# EAGLE schematic FotoMindARShield (EAGLE 7.1.0)
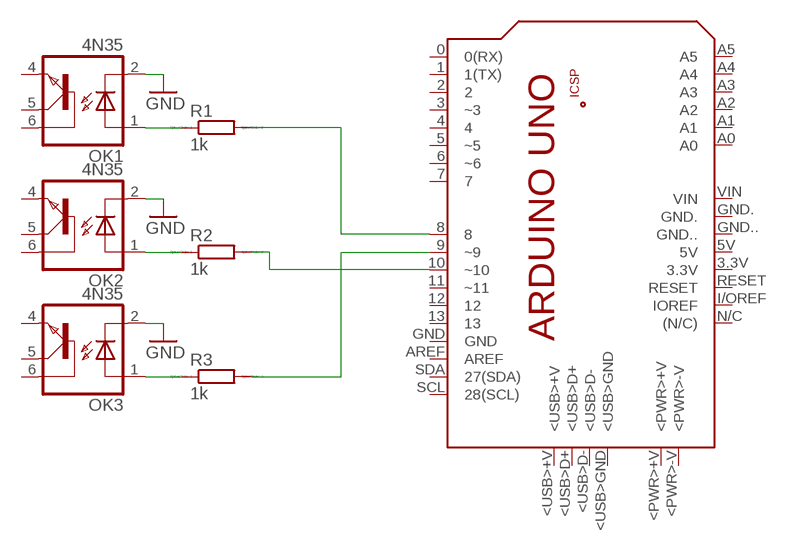
[diagram p0: schematic, sheet 1]

## Parts
OK1  4N35  [DIL06]
OK2  4N35  [DIL06]
OK3  4N35  [DIL06]
PCB1  ARDUINO_UNO  [ARDUINO_UNO]
R1  1k  R0204/7  [0204/7]
R2  1k  R0204/7  [0204/7]
R3  1k  R0204/7  [0204/7]

## Nets
GND: OK1.2(C) OK2.2(C) OK3.2(C)
N$1: OK1.1(A) R1.1
N$2: OK2.1(A) R2.1
N$3: OK3.1(A) R3.1
N$4: PCB1.8 R1.2
N$5: PCB1.10(~10) R2.2
N$6: PCB1.9(~9) R3.2
Unconnected: OK1.4(EMI) OK1.5(COL) OK1.6(BAS) OK2.4(EMI) OK2.5(COL) OK2.6(BAS) OK3.4(EMI) OK3.5(COL) OK3.6(BAS) PCB1.0(0(RX)) PCB1.1(1(TX)) PCB1.2 PCB1.3(~3) PCB1.3.3V PCB1.4 PCB1.5(~5) PCB1.5V PCB1.6(~6) PCB1.7 PCB1.11(~11) PCB1.12 PCB1.13 PCB1.+5V PCB1.<PWR>+V PCB1.<PWR>-V PCB1.<USB>+V PCB1.<USB>D+ PCB1.<USB>D- PCB1.<USB>GND PCB1.A0 PCB1.A1 PCB1.A2 PCB1.A3 PCB1.A4 PCB1.A5 PCB1.AREF PCB1.GND PCB1.GND. PCB1.GND.. PCB1.GND_ PCB1.I/OREF(IOREF) PCB1.MISO PCB1.MOSI PCB1.N/C((N/C)) PCB1.RESET PCB1.RESET. PCB1.SCK PCB1.SCL(28(SCL)) PCB1.SDA(27(SDA)) PCB1.VIN

## Library data of the parts
OK1-OK3 = optocoupler:4N35: MOTOROLA OPTO COUPLER; MF: FAIRCHILD SEMICONDUCTOR; MPN: 4N35; OC_FARNELL: 1328375; OC_NEWARK: 72K9946
PCB1 = E14_Arduino_published:ARDUINO_UNO: Device for representing an Arduino Uno board with a footprint in an EAGLE design. Created by Dave Young for Element14. More EAGLE documentation at: http://www.element14.com/community/community/knode/cadsoft_eagle
R1-R3 = eagle-ltspice:R: RESISTOR, European symbol; SPICEMODEL: NONE; SPICEPREFIX: R